# Altium schematic sheet Sheet2.SchDoc
size A
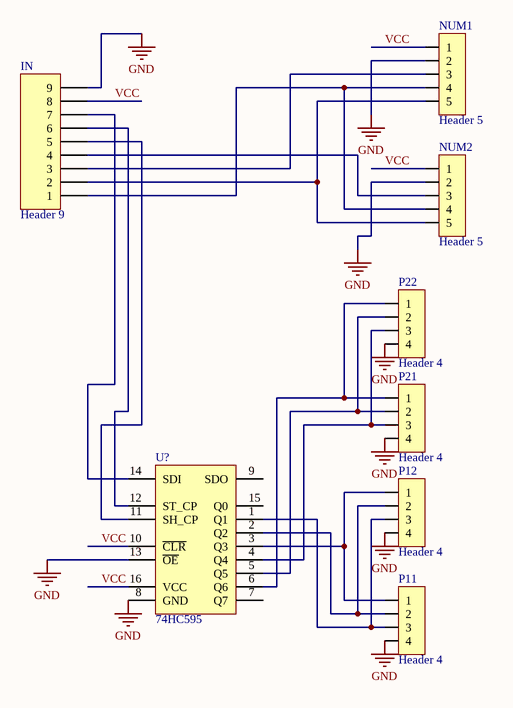
[diagram p0: Sheet2.SchDoc]

## Parts
IN  Header 9  [Header 9]
NUM1  Header 5  [Header 5]
NUM2  Header 5  [Header 5]
P11  Header 4  [Header 4]
P12  Header 4  [Header 4]
P21  Header 4  [Header 4]
P22  Header 4  [Header 4]
U?  74HC595  [DIP 16]

## Nets
GND: IN.9 NUM1.2 NUM2.2 P11.4 P12.4 P21.4 P22.4 U?.8(GND) U?.13(~{OE})
VCC: IN.8 NUM1.1 NUM2.1 U?.10(~{CLR}) U?.16(VCC)
NetIN_1: IN.1 NUM1.4 NUM2.4
NetIN_2: IN.2 NUM1.5 NUM2.5
NetIN_3: IN.3 NUM1.3
NetIN_4: IN.4 NUM2.3
NetIN_5: IN.5 U?.11(SH_CP)
NetIN_6: IN.6 U?.12(ST_CP)
NetIN_7: IN.7 U?.14(SDI)
NetP11_1: P11.1 P12.1 U?.3(Q3)
NetP11_2: P11.2 P12.2 U?.2(Q2)
NetP11_3: P11.3 P12.3 U?.1(Q1)
NetP21_1: P21.1 P22.1 U?.6(Q6)
NetP21_2: P21.2 P22.2 U?.5(Q5)
NetP21_3: P21.3 P22.3 U?.4(Q4)

Not connected (* = marked no-connect by the designer): U? 7(Q7) 9(SDO) 15(Q0)

## Library data of the parts
IN = Header 9: Header, 9-Pin; LatestRevisionDate: 17-Jul-2002; LatestRevisionNote: Re-released for DXP Platform.; Publisher: Altium Limited
NUM1 NUM2 = Header 5: Header, 5-Pin; LatestRevisionDate: 17-Jul-2002; LatestRevisionNote: Re-released for DXP Platform.; Publisher: Altium Limited
P11 P12 P21 P22 = Header 4: Header, 4-Pin
U? = 74HC595: 8-bit serial-in, serial or parallel-out  shift register with output latches;  3-state